# Altium schematic sheet Layout.SchDoc
size 147 x 139 mm
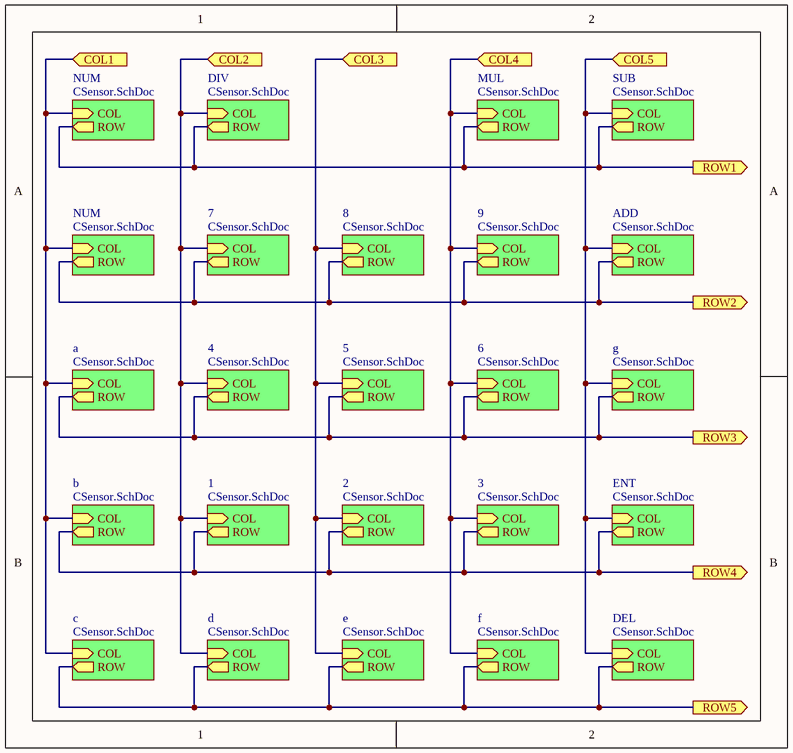
[diagram p0: Layout.SchDoc]

## Sub-sheets
1 = CSensor.SchDoc: ROW (out), COL (in)
2 = CSensor.SchDoc: ROW (out), COL (in)
3 = CSensor.SchDoc: ROW (out), COL (in)
4 = CSensor.SchDoc: ROW (out), COL (in)
5 = CSensor.SchDoc: ROW (out), COL (in)
6 = CSensor.SchDoc: ROW (out), COL (in)
7 = CSensor.SchDoc: ROW (out), COL (in)
8 = CSensor.SchDoc: ROW (out), COL (in)
9 = CSensor.SchDoc: ROW (out), COL (in)
a = CSensor.SchDoc: ROW (out), COL (in)
ADD = CSensor.SchDoc: ROW (out), COL (in)
b = CSensor.SchDoc: ROW (out), COL (in)
c = CSensor.SchDoc: ROW (out), COL (in)
d = CSensor.SchDoc: ROW (out), COL (in)
DEL = CSensor.SchDoc: ROW (out), COL (in)
DIV = CSensor.SchDoc: ROW (out), COL (in)
e = CSensor.SchDoc: ROW (out), COL (in)
ENT = CSensor.SchDoc: ROW (out), COL (in)
f = CSensor.SchDoc: ROW (out), COL (in)
g = CSensor.SchDoc: ROW (out), COL (in)
MUL = CSensor.SchDoc: ROW (out), COL (in)
NUM = CSensor.SchDoc: ROW (out), COL (in)
NUM = CSensor.SchDoc: ROW (out), COL (in)
SUB = CSensor.SchDoc: ROW (out), COL (in)

## Ports
COL1 (in), COL2 (in), COL3 (in), COL4 (in), COL5 (in), ROW1 (out), ROW2 (out), ROW3 (out), ROW4 (out), ROW5 (out)

## Nets
COL1: port COL1, sheet NUM/COL, sheet NUM/COL, sheet a/COL, sheet b/COL, sheet c/COL
COL2: port COL2, sheet DIV/COL, sheet 7/COL, sheet 4/COL, sheet 1/COL, sheet d/COL
COL3: port COL3, sheet 8/COL, sheet 5/COL, sheet 2/COL, sheet e/COL
COL4: port COL4, sheet MUL/COL, sheet 9/COL, sheet 6/COL, sheet 3/COL, sheet f/COL
COL5: port COL5, sheet SUB/COL, sheet ADD/COL, sheet g/COL, sheet ENT/COL, sheet DEL/COL
ROW1: port ROW1, sheet NUM/ROW, sheet DIV/ROW, sheet MUL/ROW, sheet SUB/ROW
ROW2: port ROW2, sheet NUM/ROW, sheet 7/ROW, sheet 8/ROW, sheet 9/ROW, sheet ADD/ROW
ROW3: port ROW3, sheet a/ROW, sheet 4/ROW, sheet 5/ROW, sheet 6/ROW, sheet g/ROW
ROW4: port ROW4, sheet b/ROW, sheet 1/ROW, sheet 2/ROW, sheet 3/ROW, sheet ENT/ROW
ROW5: port ROW5, sheet c/ROW, sheet d/ROW, sheet e/ROW, sheet f/ROW, sheet DEL/ROW